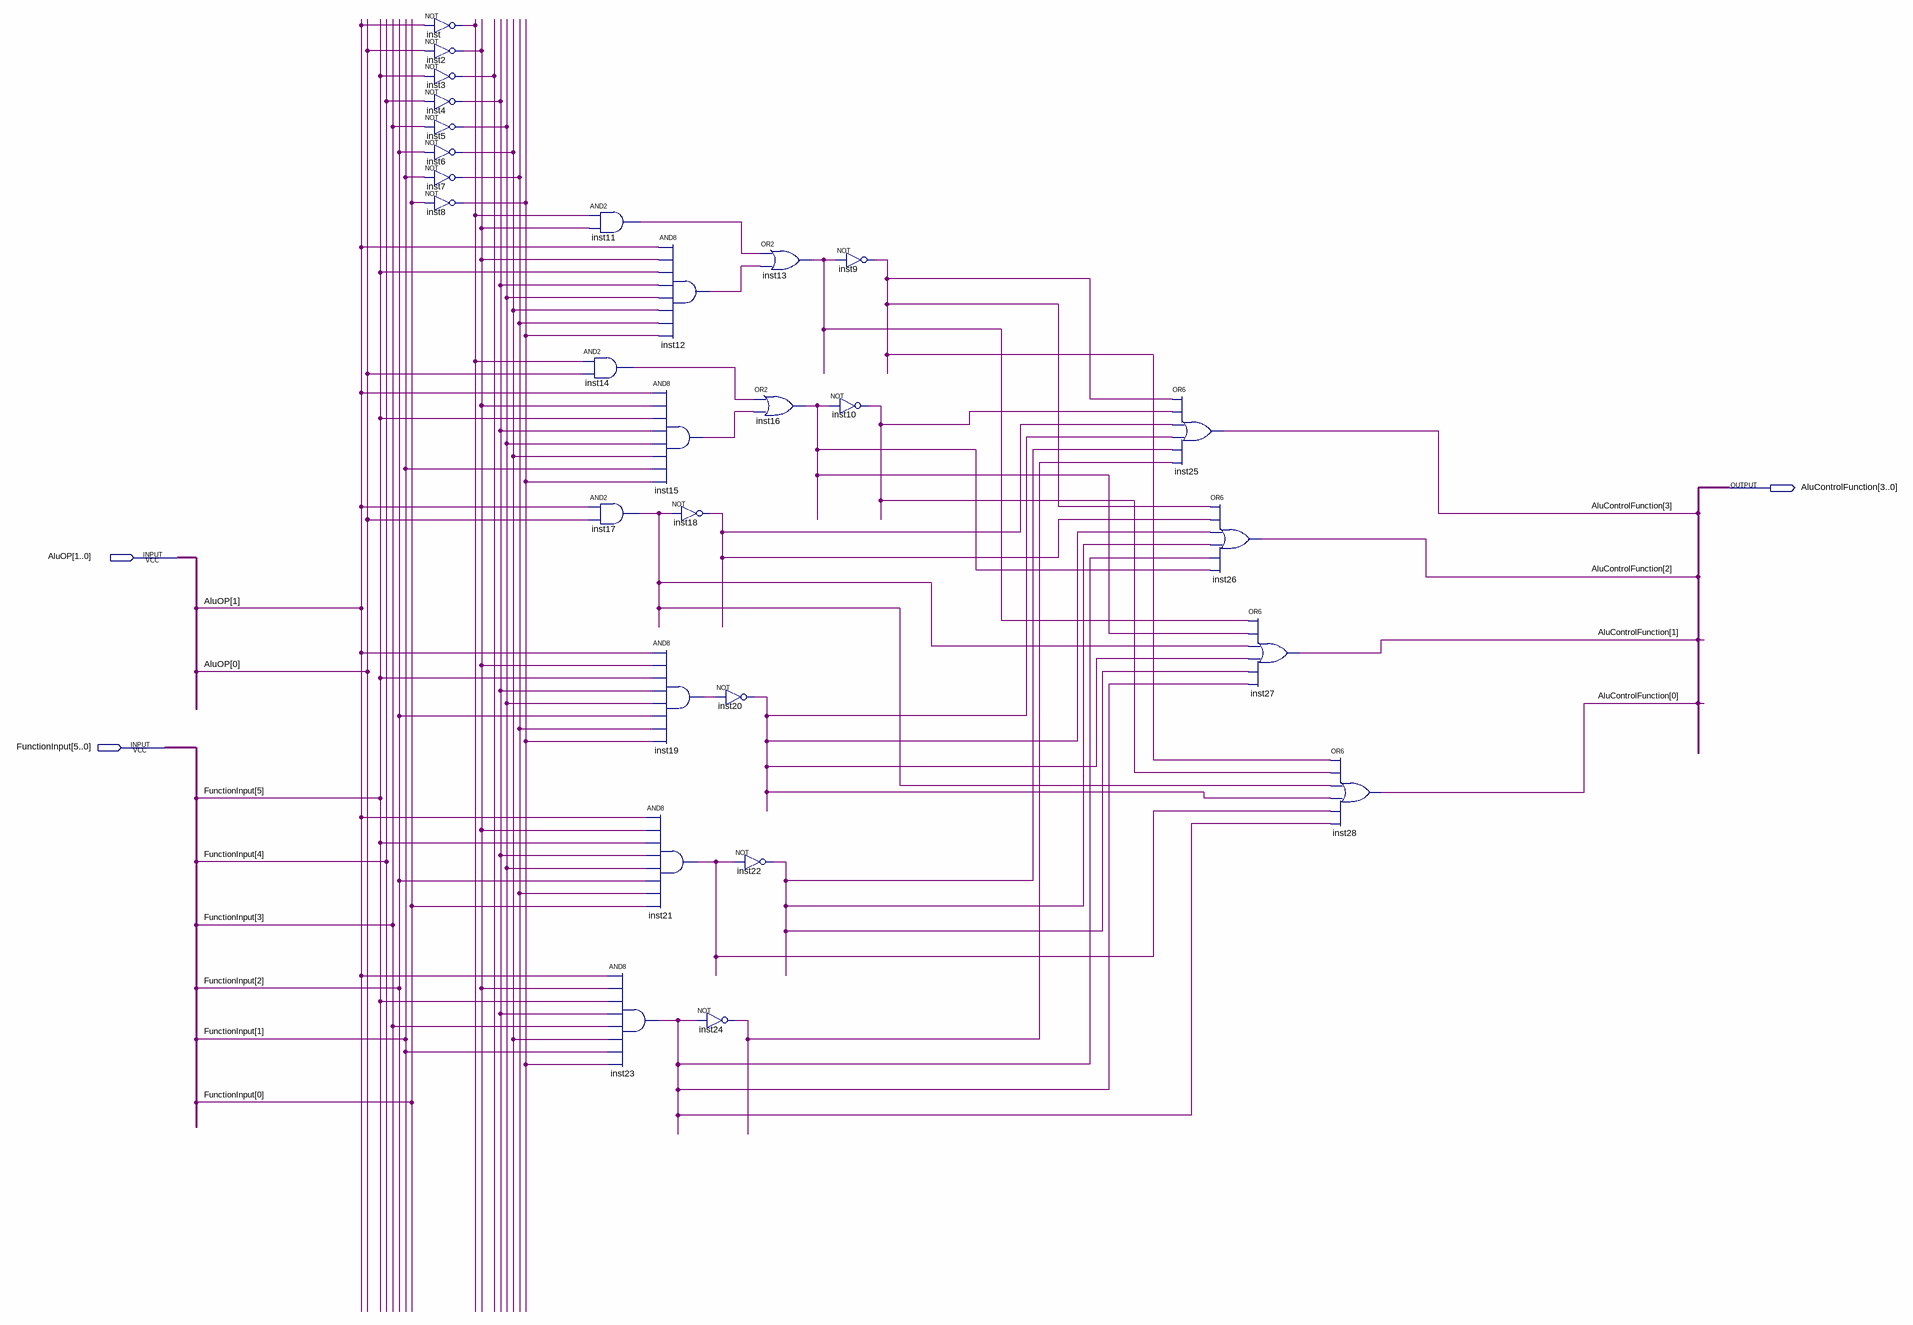
[diagram p0: schematic sheet]
// Quartus schematic alucontrol.bdf as structural Verilog: 28 symbols, 3 pins
module alucontrol (
  input  [1:0] AluOP,
  input  [5:0] FunctionInput,
  output [3:0] AluControlFunction
);

  wire inst2_out, inst3_out, inst4_out, inst5_out, inst6_out, inst7_out, inst8_out, inst9_out, inst10_out,
       inst11_out, inst12_out, inst13_out, inst14_out, inst15_out, inst16_out, inst17_out, inst18_out,
       inst19_out, inst20_out, inst21_out, inst22_out, inst23_out, inst24_out, inst_out;

  not inst (inst_out, AluOP[1]);
  not inst2 (inst2_out, AluOP[0]);
  not inst3 (inst3_out, FunctionInput[5]);
  not inst4 (inst4_out, FunctionInput[4]);
  not inst5 (inst5_out, FunctionInput[3]);
  not inst6 (inst6_out, FunctionInput[2]);
  not inst7 (inst7_out, FunctionInput[1]);
  not inst8 (inst8_out, FunctionInput[0]);
  and inst11 (inst11_out, inst_out, inst2_out);
  and inst14 (inst14_out, inst_out, AluOP[0]);
  and inst17 (inst17_out, AluOP[1], AluOP[0]);
  and inst23 (inst23_out, AluOP[1], inst2_out, FunctionInput[5], inst4_out, FunctionInput[3], inst6_out, FunctionInput[1], inst8_out);
  and inst12 (inst12_out, AluOP[1], inst2_out, FunctionInput[5], inst4_out, inst5_out, inst6_out, inst7_out, inst8_out);
  and inst15 (inst15_out, AluOP[1], inst2_out, FunctionInput[5], inst4_out, inst5_out, inst6_out, FunctionInput[1], inst8_out);
  not inst18 (inst18_out, inst17_out);
  and inst19 (inst19_out, AluOP[1], inst2_out, FunctionInput[5], inst4_out, inst5_out, FunctionInput[2], inst7_out, inst8_out);
  and inst21 (inst21_out, AluOP[1], inst2_out, FunctionInput[5], inst4_out, inst5_out, FunctionInput[2], inst7_out, FunctionInput[0]);
  not inst20 (inst20_out, inst19_out);
  not inst22 (inst22_out, inst21_out);
  not inst24 (inst24_out, inst23_out);
  or inst13 (inst13_out, inst11_out, inst12_out);
  or inst16 (inst16_out, inst14_out, inst15_out);
  not inst9 (inst9_out, inst13_out);
  not inst10 (inst10_out, inst16_out);
  or inst25 (AluControlFunction[3], inst9_out, inst10_out, inst18_out, inst20_out, inst22_out, inst24_out);
  or inst26 (AluControlFunction[2], inst9_out, inst18_out, inst20_out, inst22_out, inst23_out, inst16_out);
  or inst27 (AluControlFunction[1], inst13_out, inst16_out, inst17_out, inst20_out, inst22_out, inst23_out);
  or inst28 (AluControlFunction[0], inst9_out, inst10_out, inst17_out, inst20_out, inst21_out, inst23_out);
endmodule
